# EAGLE design akku (EAGLE 4.15)
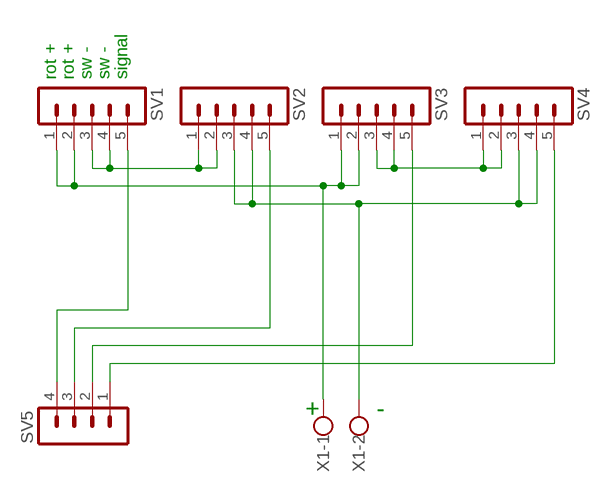
[diagram p0: schematic, sheet 1]

## Parts
SV1  MA05-1  [MA05-1]
SV2  MA05-1  [MA05-1]
SV3  MA05-1  [MA05-1]
SV4  MA05-1  [MA05-1]
SV5  MA04-1  [MA04-1]
X1  W237-102  [W237-102]

## Nets
N$1: SV4.5 SV5.1
N$2: SV3.5 SV5.2
N$3: SV2.5 SV5.3
N$4: SV1.5 SV5.4
N$5 [Versorgung]: SV2.3 SV2.4 SV4.3 SV4.4 X1.2
N$6 [Versorgung]: SV1.1 SV1.2 SV3.1 SV3.2 X1.1
N$7 [Versorgung]: SV1.3 SV1.4 SV2.1 SV2.2
N$8 [Versorgung]: SV3.3 SV3.4 SV4.1 SV4.2

## Notes on the sheet
- rot + | rot + | sw - | sw - | signal
- + | -

## Library data of the parts
SV1-SV4 = con-lstb:MA05-1: PIN HEADER
SV5 = con-lstb:MA04-1: PIN HEADER
X1 = con-wago-500:W237-102: WAGO SCREW CLAMP

## Net classes
0 default: width 0.406 mm, drill 0.305 mm
1 Versorgung: width 1.778 mm, drill 1.27 mm, clearance 0.813 mm

## Board
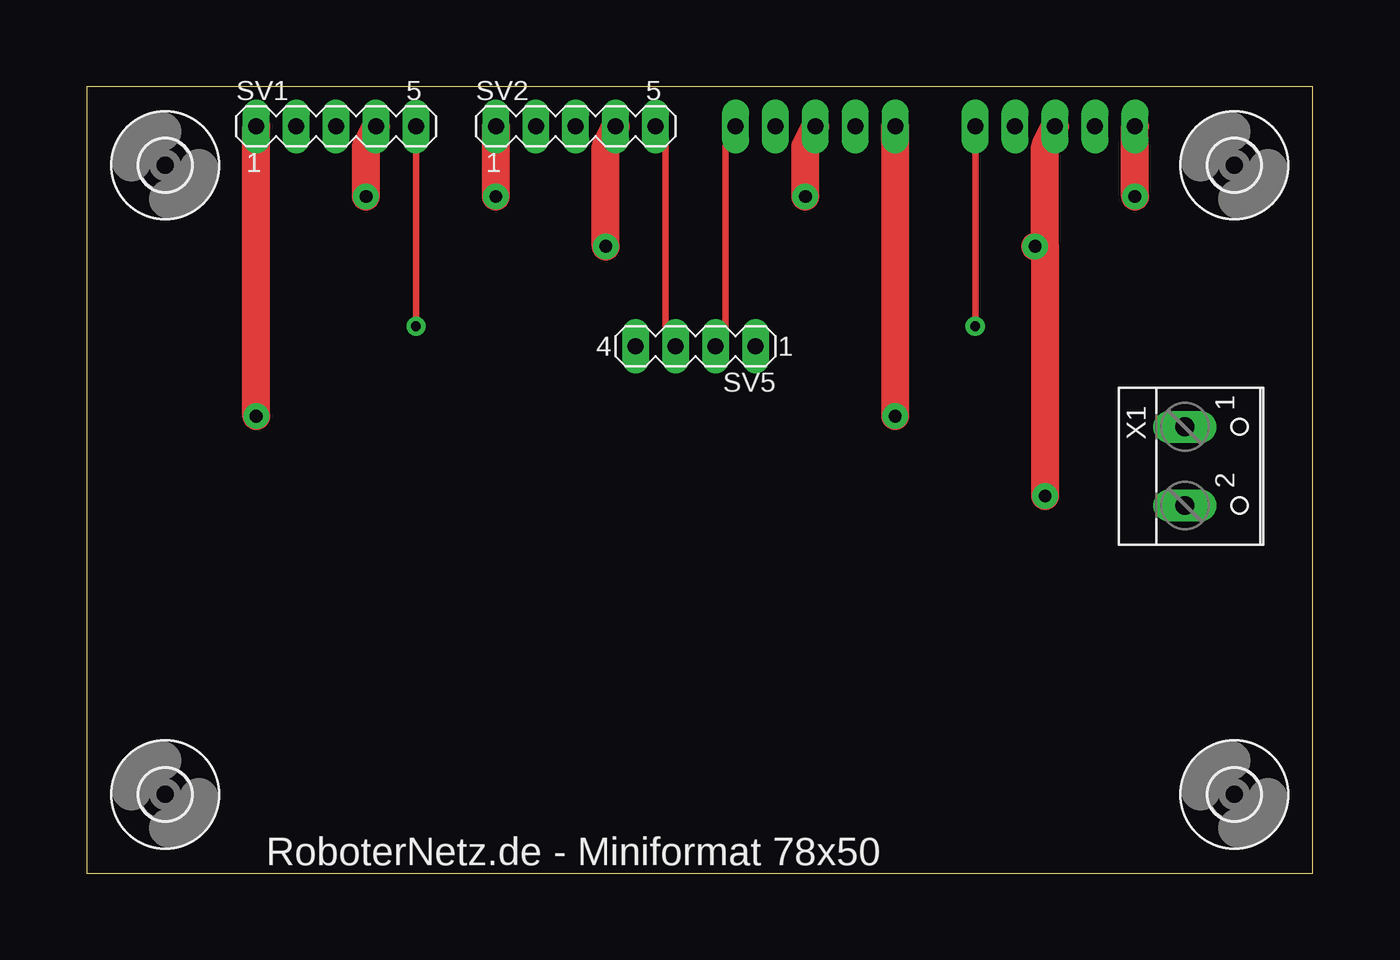
[diagram p1: board, top side]
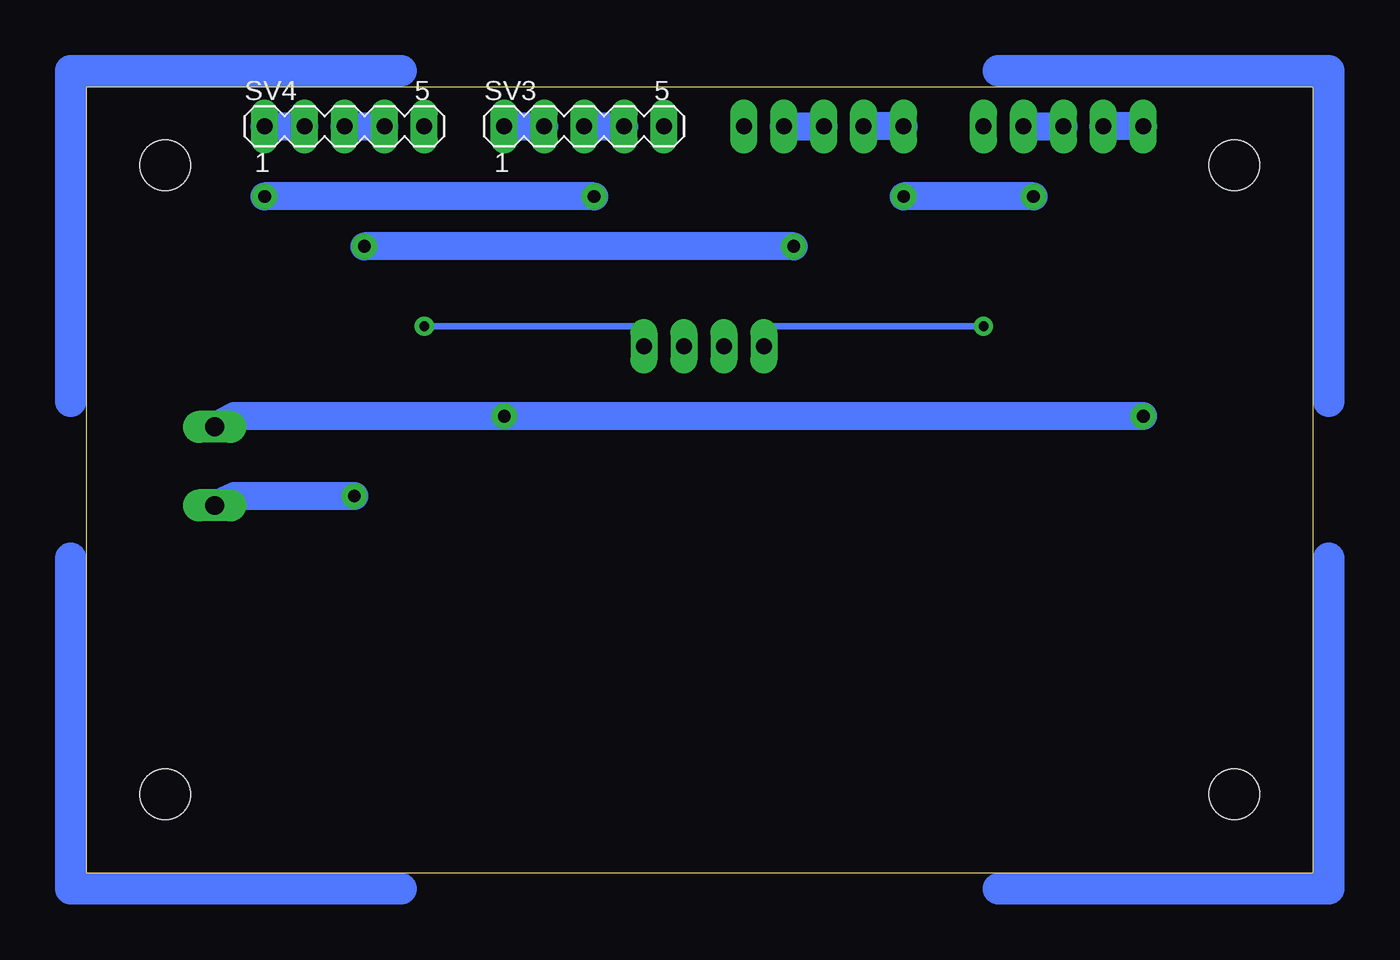
[diagram p2: board, bottom side, seen from below]

Size 78 x 50 mm. Coordinates in mm from the lower left corner, seen from the top.
Outline: 0,50 0,0 78,0 78,50 0,50
Copper layers (1*16): Top 0.035mm / dielectric 1.5mm / Bottom 0.035mm
Design rules "default": minimum track width 10mil, minimum drill 24mil, track to track 8mil, track to pad 8mil, pad to pad 8mil, via to via 8mil, smd to smd 8mil, copper to edge 40mil, drill to drill 8mil, minimum pad ring 10mil, minimum via ring 8mil, stop-mask expansion 4mil, vias tented up to drill 0mil, thermal gap 10mil

### Footprints (pad centres in the part's own frame; a part is rotated, then mirrored left to right if it is on the bottom)
MA05-1 = drill 1.016 long: 1 -5.08,0; 2 -2.54,0; 3 0,0; 4 2.54,0; 5 5.08,0
MA04-1 = drill 1.016 long: 1 -3.81,0; 2 -1.27,0; 3 1.27,0; 4 3.81,0
3,2 = hole 3.2: 0,0
W237-102 = drill 1.194 long: 1 -2.5,-1.27; 2 2.5,-1.27

### Placement (x,y rotation side)
SV1  15.88,47.46 0 top
SV2  31.11,47.46 0 top
SV3  46.35,47.46 0 bottom
SV4  61.59,47.46 0 bottom
SV5  38.73,33.49 180 top
U$1  [3,2]  5,45 270 top
U$2  [3,2]  5,5 270 top
U$3  [3,2]  73,45 270 top
U$4  [3,2]  73,5 270 top
X1  71.12,25.87 270 top

### Tracks (layer width: path | path; a pad name or v marks a point on that pad's centre or on a via)
N$1  (via drill 0.61)
  Top 0.406: v56.51,34.76 SV4.5
  Bottom 0.406: v56.51,34.76 43.18,34.76 SV5.1
N$2
  Top 0.406: SV5.2 40.64,34.76 40.64,46.19 SV3.5
N$3
  Top 0.406: SV5.3 36.83,34.76 36.83,46.19 SV2.5
N$4  (via drill 0.61)
  Top 0.406: v20.96,34.76 SV1.5
  Bottom 0.406: v20.96,34.76 34.29,34.76 SV5.4
N$5  (via drill 0.81)
  Top 1.778: 60.96,39.84 60.96,46.19 SV4.3 | 60.96,39.84 v60.96,23.96 | v33.02,39.84 33.02,46.19 SV2.4 | v60.32,39.84 60.96,39.84
  Bottom 1.778: SV2.4 SV2.3 | SV4.3 SV4.4 | v60.96,23.96 68.58,23.96 X1.2 | v33.02,39.84 v60.32,39.84
N$6  (via drill 0.81)
  Top 1.778: v51.43,29.04 SV3.1 | v10.79,29.04 SV1.1
  Bottom 1.778: SV1.1 SV1.2 | SV3.1 SV3.2 | X1.1 68.58,29.04 v51.43,29.04 v10.79,29.04
N$7  (via drill 0.81)
  Top 1.778: v17.78,43.02 17.78,46.19 SV1.4 | v26.04,43.02 SV2.1
  Bottom 1.778: SV1.4 SV1.3 | SV2.1 SV2.2 | v17.78,43.02 v26.04,43.02
N$8  (via drill 0.81)
  Top 1.778: v45.72,43.02 45.72,46.19 SV3.3 | v66.67,43.02 SV4.1
  Bottom 1.778: SV3.3 SV3.4 | SV4.1 SV4.2 | v45.72,43.02 v66.67,43.02
N$11
  Bottom 2: -1,30 -1,51 20,51
N$12
  Bottom 2: -1,20 -1,-1 20,-1
N$13
  Bottom 2: 79,30 79,51 58,51
N$14
  Bottom 2: 58,-1 79,-1 79,20

### Text on the board
tPlace: RoboterNetz.de - Miniformat 78x50